# EAGLE design ButtonDriver (EAGLE 7.2.0)
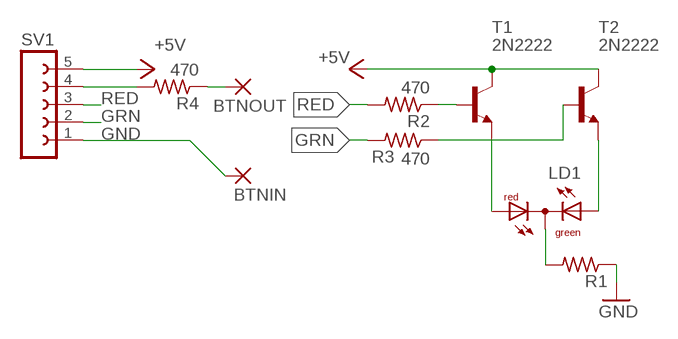
[diagram p0: schematic, sheet 1]

## Parts
BTNIN  2,54/0,9  [2,54/0,9]
BTNOUT  2,54/0,9  [2,54/0,9]
LD1  DUOLED-RG-C  [DUOLED-C-5MM]
R1  R-US_0207/10  [0207/10]
R2  470  R-US_0207/10  [0207/10]
R3  470  R-US_0207/10  [0207/10]
R4  470  R-US_0207/10  [0207/10]
SV1  FE05-1  [FE05-1]
T1  2N2222  [TO92-EBC-OVAL]
T2  2N2222  [TO92-EBC-OVAL]

## Nets
+5V: SV1.5 T1.C T2.C
GND: BTNIN.1(P) R1.1 SV1.1
GRN: R3.2 SV1.2
N$1: LD1.AR T1.E
N$2: LD1.C R1.2
N$3: LD1.AX(AG) T2.E
N$4: R3.1 T2.B
N$5: R2.1 T1.B
N$6: R4.2 SV1.4
N$7: BTNOUT.1(P) R4.1
RED: R2.2 SV1.3

## Library data of the parts
BTNIN BTNOUT = wirepad:2,54/0,9: THROUGH-HOLE PAD
LD1 = led:DUOLED-RG-C: DUO LED 2 colors (red/green), 5 mm, round, common Cathode www.ligitek.com or other producers.
R1-R4 = adafruit:R-US_: RESISTOR, American symbol
SV1 = con-lsta:FE05-1: FEMALE HEADER; OC_FARNELL: unknown; OC_NEWARK: unknown
T1 T2 = adafruit:2N2222: NPN TRANSISTOR Big oval pads

## Board
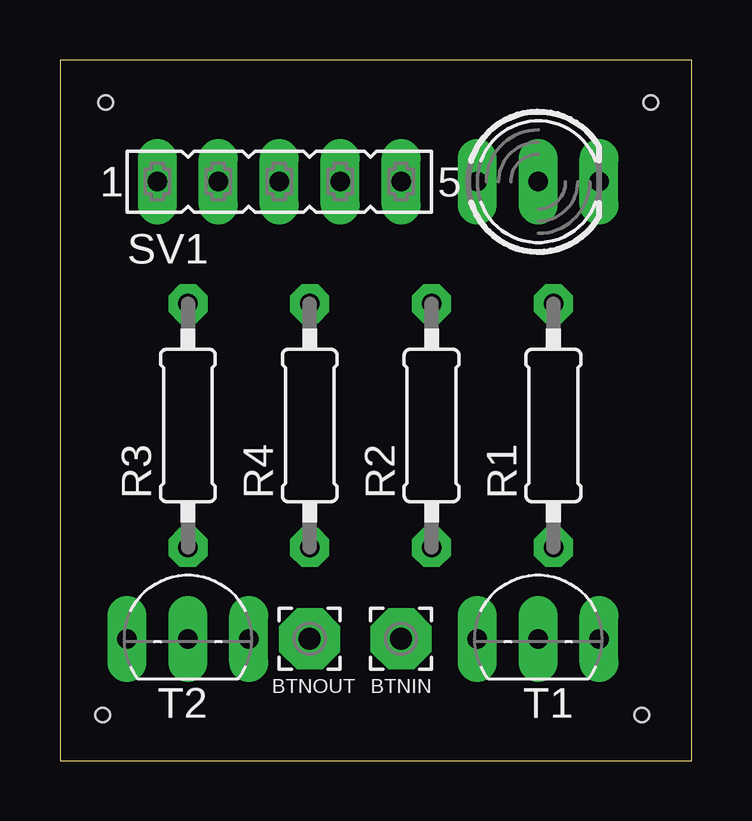
[diagram p1: board, top side]
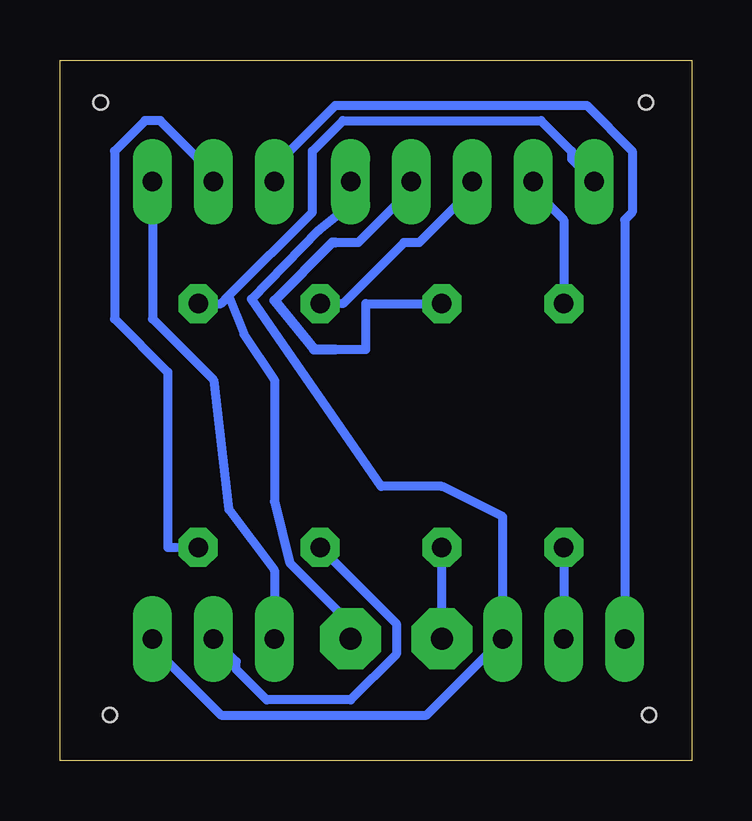
[diagram p2: board, bottom side, seen from below]

Size 26.34 x 29.2 mm. Coordinates in mm from the lower left corner, seen from the top.
Outline: 0,0 26.34,0 26.34,29.2 0,29.2 0,0
Copper layers (1*16): Top 0.035mm / dielectric 1.5mm / Bottom 0.035mm
Design rules "default *": minimum track width 15mil, minimum drill 24mil, track to track 10mil, track to pad 12mil, pad to pad 8mil, via to via 8mil, smd to smd 8mil, copper to edge 5mil, drill to drill 8mil, minimum pad ring 10mil, minimum via ring 8mil, stop-mask expansion 4mil, vias tented up to drill 0mil, thermal gap 10mil
Holes 0.6 mm at 1.78,1.91 24.26,1.91 24.64,27.43 1.91,27.43

### Footprints (pad centres in the part's own frame; a part is rotated, then mirrored left to right if it is on the bottom)
2,54/0,9 = drill 0.914 pad 2.54 octagon: 1 0,0
DUOLED-C-5MM = drill 0.813 long: AR 2.54,0; AX -2.54,0; C 0,0
0207/10 = drill 0.813 octagon: 1 -5.08,0; 2 5.08,0
FE05-1 = drill 0.813 long: 1 -5.08,0; 2 -2.54,0; 3 0,0; 4 2.54,0; 5 5.08,0
TO92-EBC-OVAL = drill 0.813 long: B 0,-1.27; C 2.54,-1.27; E -2.54,-1.27

### Placement (x,y rotation side)
BTNIN  14.22,5.08 0 top
BTNOUT  10.41,5.08 0 top
LD1  19.94,24.13 0 top
R1  20.57,13.97 270 top
R2  15.49,13.97 90 top
R3  5.33,13.97 90 top
R4  10.41,13.97 90 top
SV1  9.14,24.13 0 top
T1  19.94,6.35 0 top
T2  5.33,6.35 0 top

### Tracks (layer width: path | path; a pad name or v marks a point on that pad's centre or on a via)
+5V
  Bottom 0.381: T1.C 22.48,4.76 19.62,1.91 11.05,1.91 T2.C 7.87,10.16 10.41,11.43 12.95,11.43 18.35,19.24 15.56,22.1 14.22,23.18 SV1.5
GND
  Bottom 0.381: SV1.1 5.02,25.08 5.02,25.4 6.29,26.67 14.54,26.67 15.81,25.4 15.81,22.86 19.3,19.37 | 19.3,19.37 19.62,19.05 R1.1 | BTNIN.1 14.22,5.71 16.76,8.26 17.4,10.79 17.4,15.88 18.67,17.78 19.3,19.37
GRN
  Bottom 0.381: R3.2 5.33,22.54 6.6,23.81 SV1.2
N$1
  Bottom 0.381: T1.E 17.4,7.94 19.3,10.48 19.94,15.88 22.48,18.41 LD1.AR
N$2
  Bottom 0.381: R1.2 21.84,8.89 21.84,16.19 24.07,18.41 24.07,25.4 22.8,26.67 22.16,26.67 19.94,24.45 LD1.C
N$3
  Bottom 0.381: T2.E 2.79,22.54 2.48,22.86 2.48,25.4 4.38,27.3 14.86,27.3 17.4,24.77 LD1.AX
N$4
  Bottom 0.381: R3.1 T2.B
N$5
  Bottom 0.381: T1.B 18.99,4.13 18.99,3.81 17.72,2.54 14.22,2.54 12.32,4.45 12.32,5.71 R2.1
N$6
  Bottom 0.381: R4.2 13.59,19.05 13.59,17.14 14.86,17.14 | 14.86,21.59 13.91,21.59 11.68,23.81 SV1.4
  Bottom 0.406: 14.86,21.59 14.99,21.59 17.4,19.18 15.75,17.14 14.86,17.14
N$7
  Bottom 0.381: BTNOUT.1 R4.1
RED
  Bottom 0.381: R2.2 14.54,19.05 12,21.59 11.37,21.59 9.14,23.81 SV1.3

### Text on the board
tDocu: GND | GRN | RED | BTN | +5V | GRN | RED